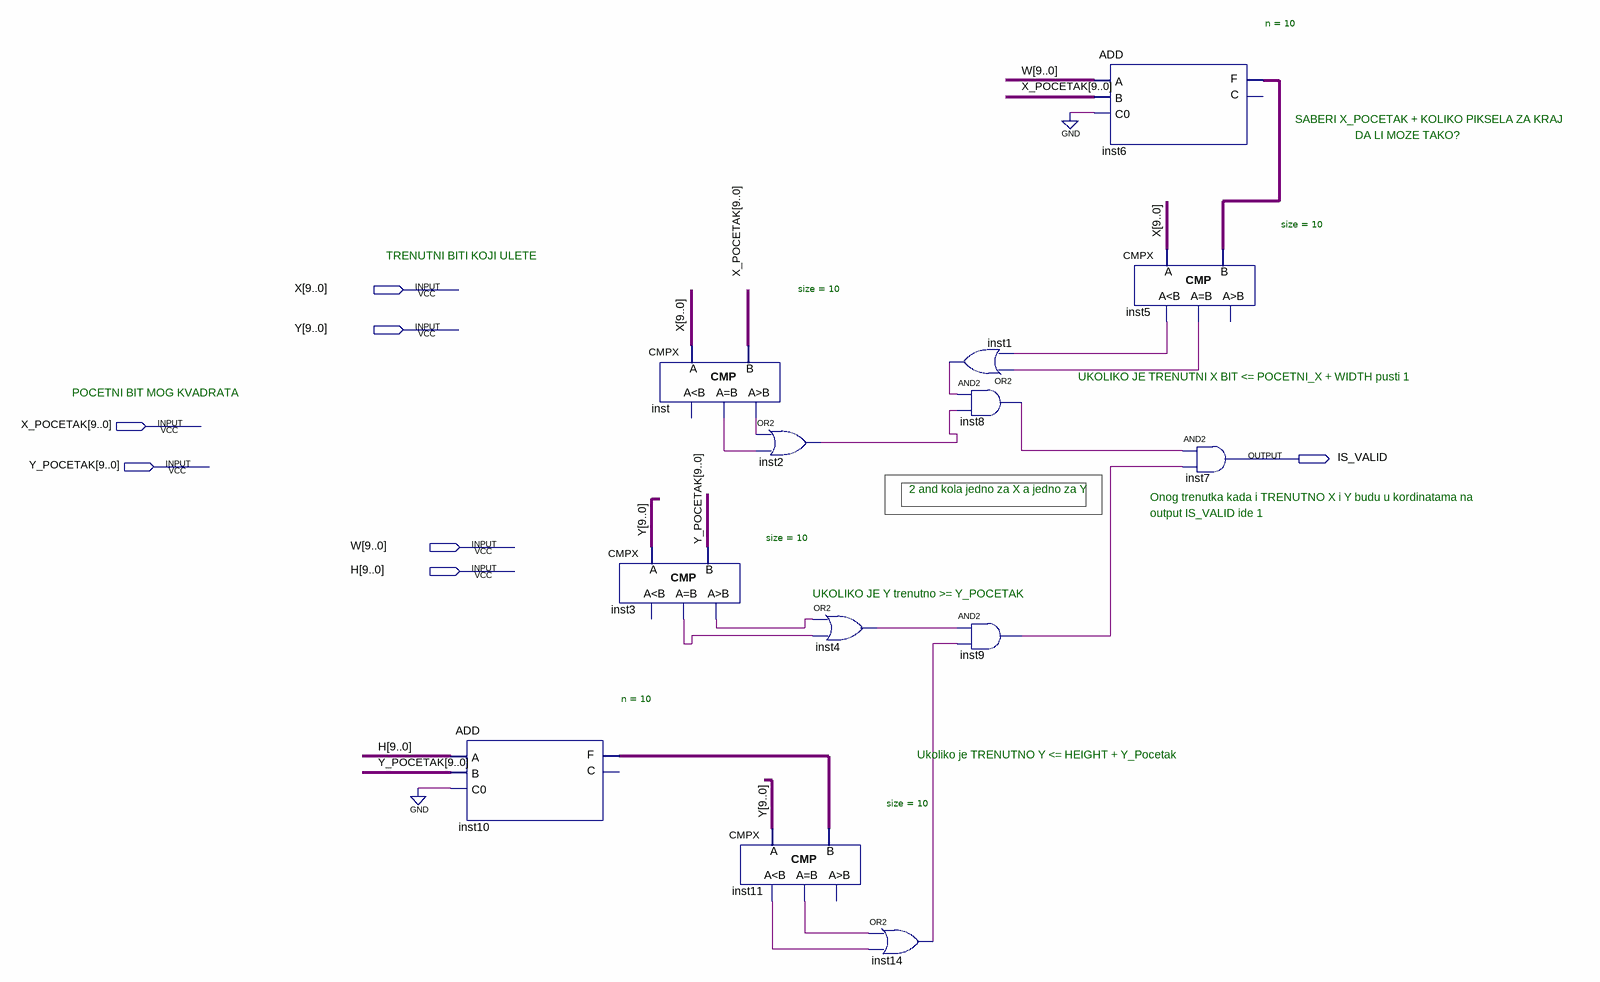
[diagram p0: schematic sheet]
// Quartus schematic IS_VALID_ZA_PREPREKE.bdf as structural Verilog: 13 symbols, 7 pins
module IS_VALID_ZA_PREPREKE (
  input  [9:0] X,
  input  [9:0] Y,
  input  [9:0] X_POCETAK,
  input  [9:0] Y_POCETAK,
  input  [9:0] W,
  input  [9:0] H,
  output IS_VALID
);

  wire inst1_out, inst2_out, inst3_eq, inst3_gr, inst4_out, inst5_eq, inst5_ls, inst8_out, inst9_out,
       inst11_eq, inst11_ls, inst14_out, inst_eq, inst_gr;
  wire [9:0] inst6_f, inst10_f;

  ADD #(.n(10)) inst10 (.C0(1'b0), .A(H), .B(Y_POCETAK), .F(inst10_f));  // open: C
  CMPX #(.size(10)) inst (.A(X), .B(X_POCETAK), .eq(inst_eq), .gr(inst_gr));  // open: ls
  CMPX #(.size(10)) inst3 (.A(Y), .B(Y_POCETAK), .eq(inst3_eq), .gr(inst3_gr));  // open: ls
  CMPX #(.size(10)) inst11 (.A(Y), .B(inst10_f), .ls(inst11_ls), .eq(inst11_eq));  // open: gr
  or inst2 (inst2_out, inst_gr, inst_eq);
  or inst4 (inst4_out, inst3_gr, inst3_eq);
  or inst14 (inst14_out, inst11_eq, inst11_ls);
  or inst1 (inst1_out, inst5_eq, inst5_ls);
  and inst8 (inst8_out, inst1_out, inst2_out);
  and inst9 (inst9_out, inst4_out, inst14_out);
  ADD #(.n(10)) inst6 (.C0(1'b0), .A(W), .B(X_POCETAK), .F(inst6_f));  // open: C
  CMPX #(.size(10)) inst5 (.A(X), .B(inst6_f), .ls(inst5_ls), .eq(inst5_eq));  // open: gr
  and inst7 (IS_VALID, inst8_out, inst9_out);

  // Notes on the sheet:
  //   SABERI X_POCETAK + KOLIKO PIKSELA ZA KRAJ
  //                       DA LI MOZE TAKO?
  //   TRENUTNI BITI KOJI ULETE 
  //   UKOLIKO JE TRENUTNI X BIT <= POCETNI_X + WIDTH pusti 1
  //   POCETNI BIT MOG KVADRATA
  //   2 and kola jedno za X a jedno za Y
  //   Onog trenutka kada i TRENUTNO X i Y budu u kordinatama na 
  //   output IS_VALID ide 1
  //   UKOLIKO JE Y trenutno >= Y_POCETAK
  //   Ukoliko je TRENUTNO Y <= HEIGHT + Y_Pocetak
endmodule
